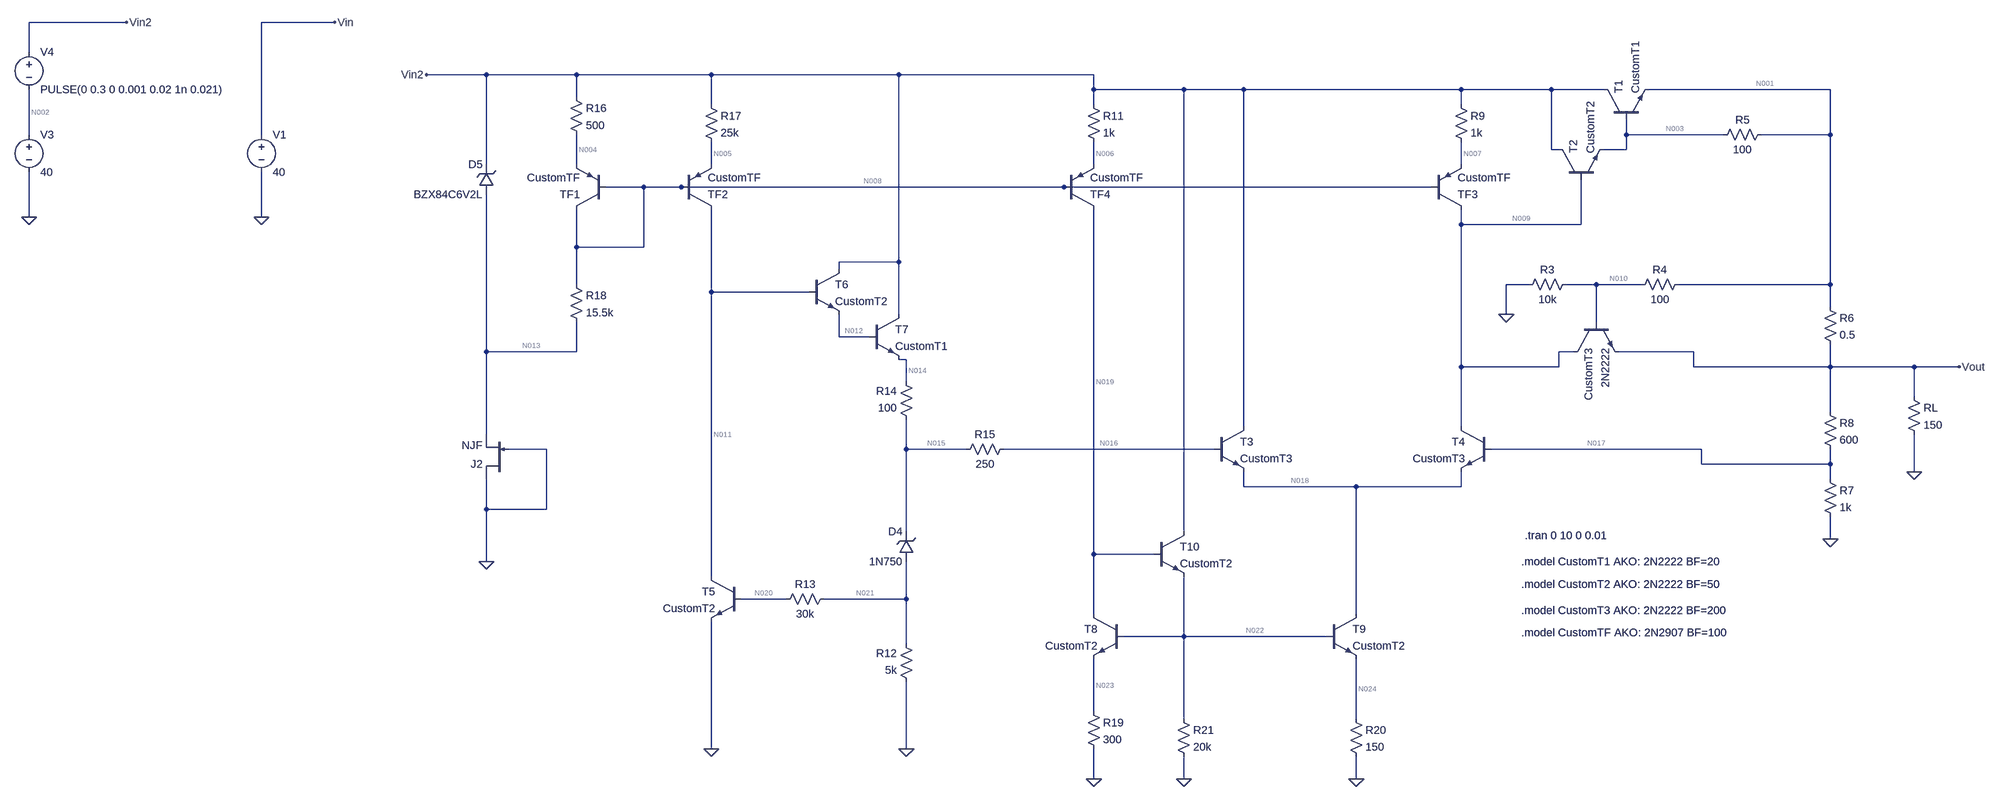
[diagram p0: schematic Test.asc]
Test.asc, the LTspice schematic file:
Version 4
SHEET 1 2264 1536
WIRE -3200 -224 -3408 -224
WIRE -2704 -224 -2912 -224
WIRE -3408 -160 -3408 -224
WIRE -2112 -112 -2240 -112
WIRE -1920 -112 -2112 -112
WIRE -1632 -112 -1920 -112
WIRE -1232 -112 -1632 -112
WIRE -816 -112 -1232 -112
WIRE -816 -80 -816 -112
WIRE -624 -80 -816 -80
WIRE -496 -80 -624 -80
WIRE -32 -80 -496 -80
WIRE 160 -80 -32 -80
WIRE 272 -80 160 -80
WIRE 864 -80 368 -80
WIRE -1920 -64 -1920 -112
WIRE -1632 -48 -1632 -112
WIRE -816 -48 -816 -80
WIRE -32 -48 -32 -80
WIRE -3408 16 -3408 -80
WIRE -2912 16 -2912 -224
WIRE 320 16 320 -16
WIRE 528 16 320 16
WIRE 864 16 864 -80
WIRE 864 16 608 16
WIRE 160 48 160 -80
WIRE 176 48 160 48
WIRE 320 48 320 16
WIRE 320 48 272 48
WIRE -2112 80 -2112 -112
WIRE -1920 80 -1920 16
WIRE -1632 80 -1632 32
WIRE -816 80 -816 32
WIRE -32 80 -32 32
WIRE -1776 128 -1856 128
WIRE -1696 128 -1776 128
WIRE -880 128 -1696 128
WIRE -96 128 -880 128
WIRE -3408 192 -3408 96
WIRE -2912 192 -2912 96
WIRE -32 208 -32 176
WIRE 224 208 224 112
WIRE 224 208 -32 208
WIRE -1920 256 -1920 176
WIRE -1776 256 -1776 128
WIRE -1776 256 -1920 256
WIRE -1232 288 -1232 -112
WIRE -1232 288 -1360 288
WIRE -1360 304 -1360 288
WIRE -1920 336 -1920 256
WIRE 112 336 64 336
WIRE 256 336 192 336
WIRE 352 336 256 336
WIRE 864 336 864 16
WIRE 864 336 432 336
WIRE -1632 352 -1632 176
WIRE -1424 352 -1632 352
WIRE 864 384 864 336
WIRE -1232 400 -1232 288
WIRE 64 400 64 336
WIRE 256 416 256 336
WIRE -1360 448 -1360 400
WIRE -1296 448 -1360 448
WIRE -2112 480 -2112 144
WIRE -1920 480 -1920 416
WIRE -1920 480 -2112 480
WIRE 208 480 176 480
WIRE 464 480 304 480
WIRE -1216 496 -1232 496
WIRE -32 512 -32 208
WIRE 176 512 176 480
WIRE 176 512 -32 512
WIRE 464 512 464 480
WIRE 864 512 864 464
WIRE 864 512 464 512
WIRE 1056 512 864 512
WIRE 1152 512 1056 512
WIRE -1216 544 -1216 496
WIRE 1056 576 1056 512
WIRE 864 608 864 512
WIRE -496 640 -496 -80
WIRE -32 640 -32 512
WIRE -2112 656 -2112 480
WIRE -1984 688 -2064 688
WIRE -1216 688 -1216 624
WIRE -1088 688 -1216 688
WIRE -560 688 -1008 688
WIRE 480 688 32 688
WIRE 480 720 480 688
WIRE 864 720 864 688
WIRE 864 720 480 720
WIRE 1056 736 1056 656
WIRE 864 752 864 720
WIRE -496 768 -496 736
WIRE -256 768 -496 768
WIRE -32 768 -32 736
WIRE -32 768 -256 768
WIRE -2112 816 -2112 752
WIRE -1984 816 -1984 688
WIRE -1984 816 -2112 816
WIRE -1216 864 -1216 688
WIRE -624 864 -624 -80
WIRE 864 880 864 832
WIRE -816 912 -816 176
WIRE -688 912 -816 912
WIRE -2112 928 -2112 816
WIRE -1632 960 -1632 352
WIRE -1472 1008 -1568 1008
WIRE -1216 1008 -1216 928
WIRE -1216 1008 -1392 1008
WIRE -816 1040 -816 912
WIRE -256 1040 -256 768
WIRE -624 1088 -624 960
WIRE -624 1088 -752 1088
WIRE -320 1088 -624 1088
WIRE -1216 1104 -1216 1008
WIRE -816 1248 -816 1136
WIRE -624 1264 -624 1088
WIRE -256 1264 -256 1136
WIRE -1632 1328 -1632 1056
WIRE -1216 1328 -1216 1184
WIRE -816 1392 -816 1328
WIRE -624 1392 -624 1344
WIRE -256 1392 -256 1344
FLAG 1056 736 0
FLAG 864 880 0
FLAG 64 400 0
FLAG -2912 192 0
FLAG 1152 512 Vout
FLAG -1216 1328 0
FLAG -1632 1328 0
FLAG -2112 928 0
FLAG -816 1392 0
FLAG -256 1392 0
FLAG -624 1392 0
FLAG -2704 -224 Vin
FLAG -3408 192 0
FLAG -3200 -224 Vin2
FLAG -2240 -112 Vin2
SYMBOL npn 176 112 R270
SYMATTR InstName T2
SYMATTR Value CustomT2
SYMBOL npn 272 -16 R270
SYMATTR InstName T1
SYMATTR Value CustomT1
SYMBOL npn 208 416 M90
SYMATTR InstName CustomT3
SYMATTR Value 2N2222
SYMBOL npn 32 640 M0
SYMATTR InstName T4
SYMATTR Value CustomT3
SYMBOL res 624 0 R90
WINDOW 0 0 56 VBottom 2
WINDOW 3 32 56 VTop 2
SYMATTR InstName R5
SYMATTR Value 100
SYMBOL res 448 320 R90
WINDOW 0 0 56 VBottom 2
WINDOW 3 32 56 VTop 2
SYMATTR InstName R4
SYMATTR Value 100
SYMBOL res 208 320 R90
WINDOW 0 0 56 VBottom 2
WINDOW 3 32 56 VTop 2
SYMATTR InstName R3
SYMATTR Value 10k
SYMBOL res 848 368 R0
SYMATTR InstName R6
SYMATTR Value 0.5
SYMBOL res 848 592 R0
SYMATTR InstName R8
SYMATTR Value 600
SYMBOL res 1040 560 R0
SYMATTR InstName RL
SYMATTR Value 150
SYMBOL res 848 736 R0
SYMATTR InstName R7
SYMATTR Value 1k
SYMBOL voltage -2912 0 R0
SYMATTR InstName V1
SYMATTR Value 40
SYMBOL npn -560 640 R0
SYMATTR InstName T3
SYMATTR Value CustomT3
SYMBOL zener -1200 928 R180
WINDOW 0 24 64 Left 2
WINDOW 3 24 0 Left 2
SYMATTR InstName D4
SYMATTR Value 1N750
SYMBOL res -1200 1200 R180
WINDOW 0 36 76 Left 2
WINDOW 3 36 40 Left 2
SYMATTR InstName R12
SYMATTR Value 5k
SYMBOL res -1488 1024 R270
WINDOW 0 32 56 VTop 2
WINDOW 3 0 56 VBottom 2
SYMATTR InstName R13
SYMATTR Value 30k
SYMBOL npn -1568 960 M0
SYMATTR InstName T5
SYMATTR Value CustomT2
SYMBOL npn -1424 304 R0
SYMATTR InstName T6
SYMATTR Value CustomT2
SYMBOL npn -1296 400 R0
SYMATTR InstName T7
SYMATTR Value CustomT1
SYMBOL res -1200 640 R180
WINDOW 0 36 76 Left 2
WINDOW 3 36 40 Left 2
SYMATTR InstName R14
SYMATTR Value 100
SYMBOL res -1104 704 R270
WINDOW 0 32 56 VTop 2
WINDOW 3 0 56 VBottom 2
SYMATTR InstName R15
SYMATTR Value 250
SYMBOL zener -2096 144 R180
WINDOW 0 24 64 Left 2
WINDOW 3 24 0 Left 2
SYMATTR InstName D5
SYMATTR Value BZX84C6V2L
SYMBOL pnp -1856 176 R180
SYMATTR InstName TF1
SYMATTR Value CustomTF
SYMBOL pnp -1696 176 M180
SYMATTR InstName TF2
SYMATTR Value CustomTF
SYMBOL res -1936 -80 R0
SYMATTR InstName R16
SYMATTR Value 500
SYMBOL res -1648 -64 R0
SYMATTR InstName R17
SYMATTR Value 25k
SYMBOL res -1936 320 R0
SYMATTR InstName R18
SYMATTR Value 15.5k
SYMBOL njf -2064 752 R180
SYMATTR InstName J2
SYMBOL pnp -96 176 M180
SYMATTR InstName TF3
SYMATTR Value CustomTF
SYMBOL res -48 -64 R0
SYMATTR InstName R9
SYMATTR Value 1k
SYMBOL pnp -880 176 M180
SYMATTR InstName TF4
SYMATTR Value CustomTF
SYMBOL res -832 -64 R0
SYMATTR InstName R11
SYMATTR Value 1k
SYMBOL npn -752 1040 M0
SYMATTR InstName T8
SYMATTR Value CustomT2
SYMBOL npn -320 1040 R0
SYMATTR InstName T9
SYMATTR Value CustomT2
SYMBOL res -832 1232 R0
SYMATTR InstName R19
SYMATTR Value 300
SYMBOL res -272 1248 R0
SYMATTR InstName R20
SYMATTR Value 150
SYMBOL npn -688 864 R0
SYMATTR InstName T10
SYMATTR Value CustomT2
SYMBOL res -640 1248 R0
SYMATTR InstName R21
SYMATTR Value 20k
SYMBOL voltage -3408 0 R0
SYMATTR InstName V3
SYMATTR Value 40
SYMBOL voltage -3408 -176 R0
SYMATTR InstName V4
SYMATTR Value PULSE(0 0.3 0 0.001 0.02 1n 0.021)
TEXT 96 928 Left 2 !.model CustomT1 AKO: 2N2222 BF=20
TEXT 96 976 Left 2 !.model CustomT2 AKO: 2N2222 BF=50
TEXT 96 1032 Left 2 !.model CustomT3 AKO: 2N2222 BF=200
TEXT 104 872 Left 2 !.tran 0 10 0 0.01
TEXT 96 1080 Left 2 !.model CustomTF AKO: 2N2907 BF=100

The netlist it stands for:
* Test.asc
Q§T2 Vin2 N009 N003 0 CustomT2
Q§T1 Vin2 N003 N001 0 CustomT1
Q§CustomT3 N009 N010 Vout 0 2N2222
Q§T4 N009 N017 N018 0 CustomT3
R5 N001 N003 100
R4 N001 N010 100
R3 N010 0 10k
R6 N001 Vout 0.5
R8 Vout N017 600
RL Vout 0 150
R7 N017 0 1k
V1 Vin 0 40
Q§T3 Vin2 N016 N018 0 CustomT3
D4 N021 N015 1N750
R12 0 N021 5k
R13 N020 N021 30k
Q§T5 N011 N020 0 0 CustomT2
Q§T6 Vin2 N011 N012 0 CustomT2
Q§T7 Vin2 N012 N014 0 CustomT1
R14 N015 N014 100
R15 N015 N016 250
D5 N013 Vin2 BZX84C6V2L
Q§TF1 N008 N008 N004 0 CustomTF
Q§TF2 N011 N008 N005 0 CustomTF
R16 Vin2 N004 500
R17 Vin2 N005 25k
R18 N008 N013 15.5k
J2 0 0 N013 NJF
Q§TF3 N009 N008 N007 0 CustomTF
R9 Vin2 N007 1k
Q§TF4 N019 N008 N006 0 CustomTF
R11 Vin2 N006 1k
Q§T8 N019 N022 N023 0 CustomT2
Q§T9 N018 N022 N024 0 CustomT2
R19 N023 0 300
R20 N024 0 150
Q§T10 Vin2 N019 N022 0 CustomT2
R21 N022 0 20k
V3 N002 0 40
V4 Vin2 N002 PULSE(0 0.3 0 0.001 0.02 1n 0.021)
.model D D
.lib standard.dio
.model NPN NPN
.model PNP PNP
.lib standard.bjt
.model NJF NJF
.model PJF PJF
.lib standard.jft
.model CustomT1 AKO: 2N2222 BF=20
.model CustomT2 AKO: 2N2222 BF=50
.model CustomT3 AKO: 2N2222 BF=200
.tran 0 10 0 0.01
.model CustomTF AKO: 2N2907 BF=100
.backanno
.end

* Results of the author's LTspice run, read from the files saved beside the schematic
* Operating Point, zero values left out:
*   V(vin2) = 40 V
*   V(n009) = 8.03 V
*   V(n003) = 7.321 V
*   V(n001) = 6.552 V
*   V(n010) = 6.487 V
*   V(vout) = 6.528 V
*   V(n017) = 4.08 V
*   V(n018) = 3.507 V
*   V(vin) = 40 V
*   V(n016) = 4.119 V
*   V(n021) = 541.6 mV
*   V(n015) = 4.119 V
*   V(n020) = 535.7 mV
*   V(n011) = 5.223 V
*   V(n012) = 4.719 V
*   V(n014) = 4.13 V
*   V(n013) = 34.01 V
*   V(n008) = 39.21 V
*   V(n004) = 39.83 V
*   V(n005) = 39.74 V
*   V(n007) = 39.81 V
*   V(n019) = 1.233 V
*   V(n006) = 39.81 V
*   V(n022) = 668.4 mV
*   V(n023) = 56.89 mV
*   V(n024) = 45.34 mV
*   V(n002) = 40 V
*   Ic(Tf4) = -186.5 µA
*   Ib(Tf4) = -1.418 µA
*   Ie(Tf4) = 187.9 µA
*   Ic(Tf3) = -185.5 µA
*   Ib(Tf3) = -1.473 µA
*   Ie(Tf3) = 187 µA
*   Ic(Tf2) = -10.4 µA
*   Ib(Tf2) = -81.01 nA
*   Ie(Tf2) = 10.48 µA
*   Ic(Tf1) = -328.9 µA
*   Ib(Tf1) = -3.293 µA
*   Ie(Tf1) = 332.2 µA
*   Ic(T3) = 251.9 µA
*   Ib(T3) = 927.5 nA
*   Ie(T3) = -252.9 µA
*   Ic(T4) = 43.43 µA
*   Ib(T4) = 208.9 nA
*   Ie(T4) = -43.64 µA
*   Ic(Customt3) = 1.54 pA
*   Ib(Customt3) = -1.588 pA
*   Ic(T7) = 105.5 µA
*   Ib(T7) = 3.902 µA
*   Ie(T7) = -109.5 µA
*   Ic(T1) = 38.95 mA
*   Ib(T1) = 1.611 mA
*   Ie(T1) = -40.56 mA
*   Ic(T10) = 42.28 µA
*   Ib(T10) = 609.4 nA
*   Ie(T10) = -42.89 µA
*   Ic(T9) = 296.5 µA
*   Ib(T9) = 5.772 µA
*   Ie(T9) = -302.3 µA
*   Ic(T8) = 185.9 µA
*   Ib(T8) = 3.7 µA
*   Ie(T8) = -189.6 µA
*   Ic(T6) = 3.845 µA
*   Ib(T6) = 57.02 nA
*   Ie(T6) = -3.902 µA
*   Ic(T5) = 10.34 µA
*   Ib(T5) = 197.6 nA
*   Ie(T5) = -10.54 µA
*   Ic(T2) = 9.161 mA
*   Ib(T2) = 142 µA
*   Ie(T2) = -9.303 mA
*   I(D5) = -64.83 µA
*   I(D4) = -108.5 µA
*   Id(J2) = -400 µA
*   Ig(J2) = -34.02 pA
*   Is(J2) = 400 µA
*   I(R21) = 33.42 µA
*   I(R20) = 302.3 µA
*   I(R19) = 189.6 µA
*   I(R11) = 187.9 µA
*   I(R9) = 187 µA
*   I(R18) = 335.2 µA
*   I(R17) = 10.48 µA
*   I(R16) = 332.2 µA
*   I(R15) = 927.5 nA
*   I(R14) = -109.5 µA
*   I(R13) = -197.6 nA
*   I(R12) = -108.3 µA
*   I(R7) = 4.08 mA
*   I(Rl) = 43.52 mA
*   I(R8) = 4.08 mA
*   I(R6) = 47.6 mA
*   I(R3) = 648.7 µA
*   I(R4) = 648.7 µA
*   I(R5) = -7.692 mA
*   I(V4) = -49.3 mA
*   I(V3) = -49.3 mA
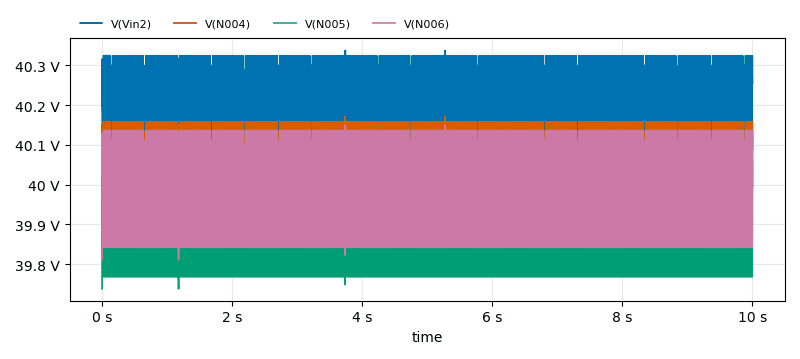
[diagram p1: Transient Analysis of Test.asc, plotted from the saved traces]
* Transient Analysis, 1 run:
*   V(Vin2): min 40 V, max 40.34 V, average 40.16 V, rms 40.16 V, last 40.26 V
*   V(N004): min 39.83 V, max 40.17 V, average 40 V, rms 40 V, last 40.09 V
*   V(N005): min 39.74 V, max 40.08 V, average 39.9 V, rms 39.9 V, last 39.99 V
*   V(N006): min 39.81 V, max 40.15 V, average 39.98 V, rms 39.98 V, last 40.07 V